# EAGLE design APC1 (EAGLE 7.5.0)
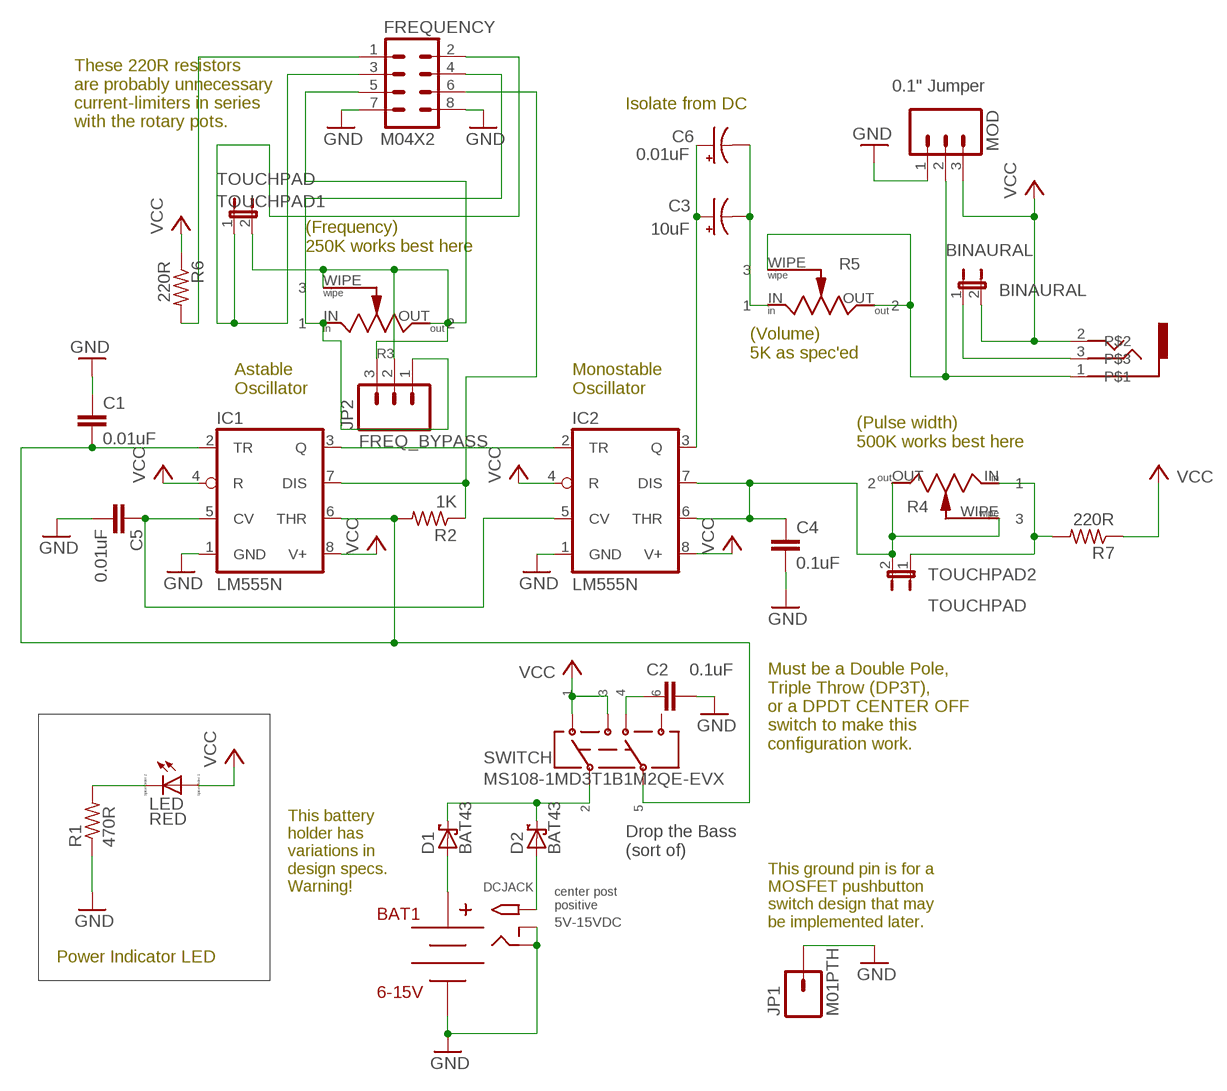
[diagram p0: schematic, sheet 1]

## Parts
BAT1  6-15V  BH-9VPC  [BH9VPC]
BINAURAL  BINAURAL  JP1E  [JP1]
C1  0.01uF  C-EU050-024X044  [C050-024X044]
C2  0.1uF  C-EU050-024X044  [C050-024X044]
C3  10uF  CPOL-USE2.5-7  [E2,5-7]
C4  0.1uF  C-EU050-024X044  [C050-024X044]
C5  0.01uF  C-EU050-024X044  [C050-024X044]
C6  0.01uF  CPOL-USE2.5-7  [E2,5-7]
D1  BAT43  SCHOTTKY-DIODEDO35-7  [DO35-7]
D2  BAT43  SCHOTTKY-DIODEDO35-7  [DO35-7]
DCJACK  PJ102A  [PJ-102A]
FREQUENCY  M04X2  [2X4]
IC1  LM555N  [DIL08]
IC2  LM555N  [DIL08]
JP1  M01PTH  [1X01]
JP2  FREQ_BYPASS  M03SMD_RA_MALE  [1X03_SMD_RA_MALE]
LED  RED  LED_ELD260  [LED_LD260]
LINE  SJ-3523-SMT  [SJ352_AUDIOJACK]
MOD  0.1" Jumper  M03LOCK  [1X03_LOCK]
R1  470R  R-US_0207/7  [0207/7]
R2  1K  R-US_0207/7  [0207/7]
R3  CTS_UM296RE_SERIES_POTENTIOMETERUM296RE  [UM296RE_POTENTIOMETER]
R4  CTS_UM296RE_SERIES_POTENTIOMETERUM296RE  [UM296RE_POTENTIOMETER]
R5  CTS_UM296RE_SERIES_POTENTIOMETERUM296RE  [UM296RE_POTENTIOMETER]
R6  220R  R-US_0207/7  [0207/7]
R7  220R  R-US_0207/7  [0207/7]
SWITCH  MS108-1MD3T1B1M2QE-EVX  [MS108-1MD3T1B1M2QE-EVX]
TOUCHPAD1  TOUCHPAD  JP1E  [JP1]
TOUCHPAD2  TOUCHPAD  JP1E  [JP1]

## Nets
GND: BAT1.P$1(V-) C1.1 C2.2 C4.2 C5.2 DCJACK.P$2(RING) DCJACK.P$3(RING_SW) FREQUENCY.7 FREQUENCY.8 IC1.1(GND) IC2.1(GND) JP1.1 MOD.1 R1.1
N$1: FREQUENCY.5 JP2.2 JP2.3 R3.OUT R3.WIPE TOUCHPAD1.2
N$2: C2.1 SWITCH.P$4
N$3: C4.1 IC2.6(THR) IC2.7(DIS) R4.OUT R4.WIPE TOUCHPAD2.2
N$4: IC1.3(Q) IC2.2(TR)
N$5: C5.1 IC1.5(CV) IC2.5(CV)
N$6: LED.K(C) R1.2
N$7: BINAURAL.1 LINE.3
N$8: C3.+ C6.+ IC2.3(Q)
N$9: C1.2 IC1.2(TR) IC1.6(THR) R2.2 SWITCH.P$5
N$10: BAT1.P$2(V+) D1.A
N$11: D2.A DCJACK.P$1(TIP)
N$13: LINE.1 MOD.2 R5.OUT R5.WIPE
N$14: R4.IN R7.2 TOUCHPAD2.1
N$15: FREQUENCY.2 FREQUENCY.3 TOUCHPAD1.1
N$16: C3.- C6.- R5.IN
N$18: FREQUENCY.1 R6.2
N$19: FREQUENCY.4 JP2.1 R3.IN
N$20: FREQUENCY.6 IC1.7(DIS) R2.1
VCC: BINAURAL.2 IC1.4(R) IC1.8(V+) IC2.4(R) IC2.8(V+) LED.A LINE.2 MOD.3 R6.1 R7.1 SWITCH.P$1 SWITCH.P$3
VIN: D1.C D2.C SWITCH.P$2
Unconnected: SWITCH.P$6

## Notes on the sheet
- Isolate from DC
- These 220R resistors
  are probably unnecessary
  current-limiters in series 
  with the rotary pots.
- (Frequency)
  250K works best here
- (Volume)
  5K as spec'ed
- Astable 
  Oscillator
- Monostable 
  Oscillator
- (Pulse width)
  500K works best here
- Must be a Double Pole,
  Triple Throw (DP3T),
  or a DPDT CENTER OFF
  switch to make this
  configuration work.
- Drop the Bass
  (sort of)
- This battery
  holder has
  variations in
  design specs.
  Warning!
- center post
  positive
- 5V-15VDC
- This ground pin is for a
  MOSFET pushbutton
  switch design that may 
  be implemented later.
- Power Indicator LED

## Library data of the parts
BAT1 = HAMNER:BH-9VPC: These specs, though the battery holder is imprinted with BH-9VPC, match the specs of part number 12BH611-GR. There is another part with SKU BH-9VPC, but very unfortunately, the specs are not quite the same. Apparently the manufacturer was purchased by another conglomerate, resulting in some new/old stock components with identical SKUs.
BINAURAL TOUCHPAD1 TOUCHPAD2 = jumper:JP1E: JUMPER
C1 C2 C4 C5 = rcl:C-EU: CAPACITOR, European symbol
C3 C6 = rcl:CPOL-US: POLARIZED CAPACITOR, American symbol
D1 D2 = adafruit:SCHOTTKY-DIODE: Schottky Diode
DCJACK = HAMNER:PJ102A
FREQUENCY = SparkFun-Connectors:M04X2: .1" header, two rows of four.
IC1 IC2 = linear:*555: TIMER
JP1 = SparkFun-Connectors:M01: Header 1 Standard 1-pin 0.1" header. Use with straight break away headers (SKU : PRT-00116), right angle break away headers (PRT-00553), swiss pins (PRT-00743), machine pins (PRT-00117), and female headers (PRT-00115).
JP2 = SparkFun-Connectors:M03: Header 3 Standard 3-pin 0.1" header. Use with straight break away headers (SKU : PRT-00116), right angle break away headers (PRT-00553), swiss pins (PRT-00743), machine pins (PRT-00117), and female headers (PRT-00115). Molex polarized connector foot print use with SKU : PRT-08232 with associated crimp pins and housings.; PROD_ID: CONN-10925
LED = eagle-ltspice:LED_E: LED Source: http://www.osram.convergy.de Source: www.luxeon.com Source: www.kingbright.com; SPICEMODEL: NONE; SPICEPREFIX: D; SPICETYPE: diode
LINE = HAMNER:SJ-3523-SMT: CUI inc Stereo Audio SMT jack, 3.5mm http://www.digikey.com/product-detail/en/SJ-3523-SMT-TR/CP-3523SJCT-ND/669704
MOD = SparkFun-Connectors:M03: Header 3 Standard 3-pin 0.1" header. Use with straight break away headers (SKU : PRT-00116), right angle break away headers (PRT-00553), swiss pins (PRT-00743), machine pins (PRT-00117), and female headers (PRT-00115). Molex polarized connector foot print use with SKU : PRT-08232 with associated crimp pins and housings.
R1 R2 R6 R7 = rcl:R-US_: RESISTOR, American symbol
R3-R5 = HAMNER:CTS_UM296RE_SERIES_POTENTIOMETER: CTS 296 U series rotary potentiometer / rheostat / varistor / variable resistor. 2009 datasheet vintage. "U" series means "adjustment shaft is perpendicular to the mounting surface". "M" denotes "molded [plastic] shaft." Datasheet <http://www.ctscorp.com/wp-content/uploads/2015/11/296.pdf>. Digikey: Link as of 2016 <http://www.digikey.com/product-search/en/potentiometers-variable-resistors/rotary-potentiometers-rheostats/263488?s=937&page=1&quantity=0&ptm=0&fid=0&pageSize=25>. Resistor Max Value Digikey Part Number Manufacturer Part Number 5K Ohm CT2264-ND 296UD502B1N 100K Ohm CT2268-ND 296UD104B1N 250K Ohm CT2269-ND 296UD254B1N 500K Ohm CT2270-ND 296UD504B1N Mouser: Link as of 2016 <http://www.mouser.com/CTS/Passive-Components/Potentiometers-Trimmers-Rheostats/Potentiometers/296-Series/_/N-9q0yp?P=1ynwx3nZ1yzshzu>, but item is non-stocked and only available in lots of 2000.
SWITCH = HAMNER:MS108-1MD3T1B1M2QE-EVX: Mountain Switch Toggle DPDT model 108-1MD3T1B1M2QE-EVX This model has a center-off (no connection) position It is available from Mouser, part number 108-1MD3T1B1M2QE-EVX Mouser link as of 2016: here <http://www.mouser.com/ProductDetail/Mountain-Switch/108-1MD3T1B1M2QE-EVX/>. Digikey does not carry the part as of 2016. Amazon carries the part, but only in lots of 500.; MOUSER: 108-1MD3T1B1M2QE-EVX

## Board
Atari Punk Console version 1.0 Jesse Hamner UNT Libraries January 2017 In 1983 or some time before that, Forrest Mims III, a legend among the electronics and hobbyist communities, designed the "Stepped Tone Generator" using the wildly popular and hugely versatile 555 timer integrated circuit. He published the design in a Radio Shack (Tandy Corp) book of projects, and then again some time later in another of the "Notebook" series. I was unable to find a design for this board online that presented a simple design and an easy soldering task, but also added a few bits of hackability. People who are getting in to electronics, soldering, and/or "making" need a few easy "wins" for their first few projects, and the "Atari Punk Console", as it has become known, is a simple circuit with a modest amount of expandability. As such, I think this design, as I have re-implemented it, provides a great series of stepping stones from novice, through to a more seasoned "maker". The UNT Libraries makerspace, the Factory, provides a number of makerspace-standard tools to the end users, but like many tools, learning to use them can be a challenge. Here again, this design of the APC is up to the task. With easy alignment notches and a downloadable reference design for a 3D-printed case, users can learn to solder, solder the APC, and print a case for it, without facing serious hurdles. It is my hope that projects such as these provide small curricula, allowing novices to gain experience in several aspects of hobbyist making, while not facing the full force of electrical or industrial engineering. One should not be required to learn typesetting in order to print a Microsoft Word document; neither should one be required to understand G-Code or STL files in order to produce a working and fun electronics project.
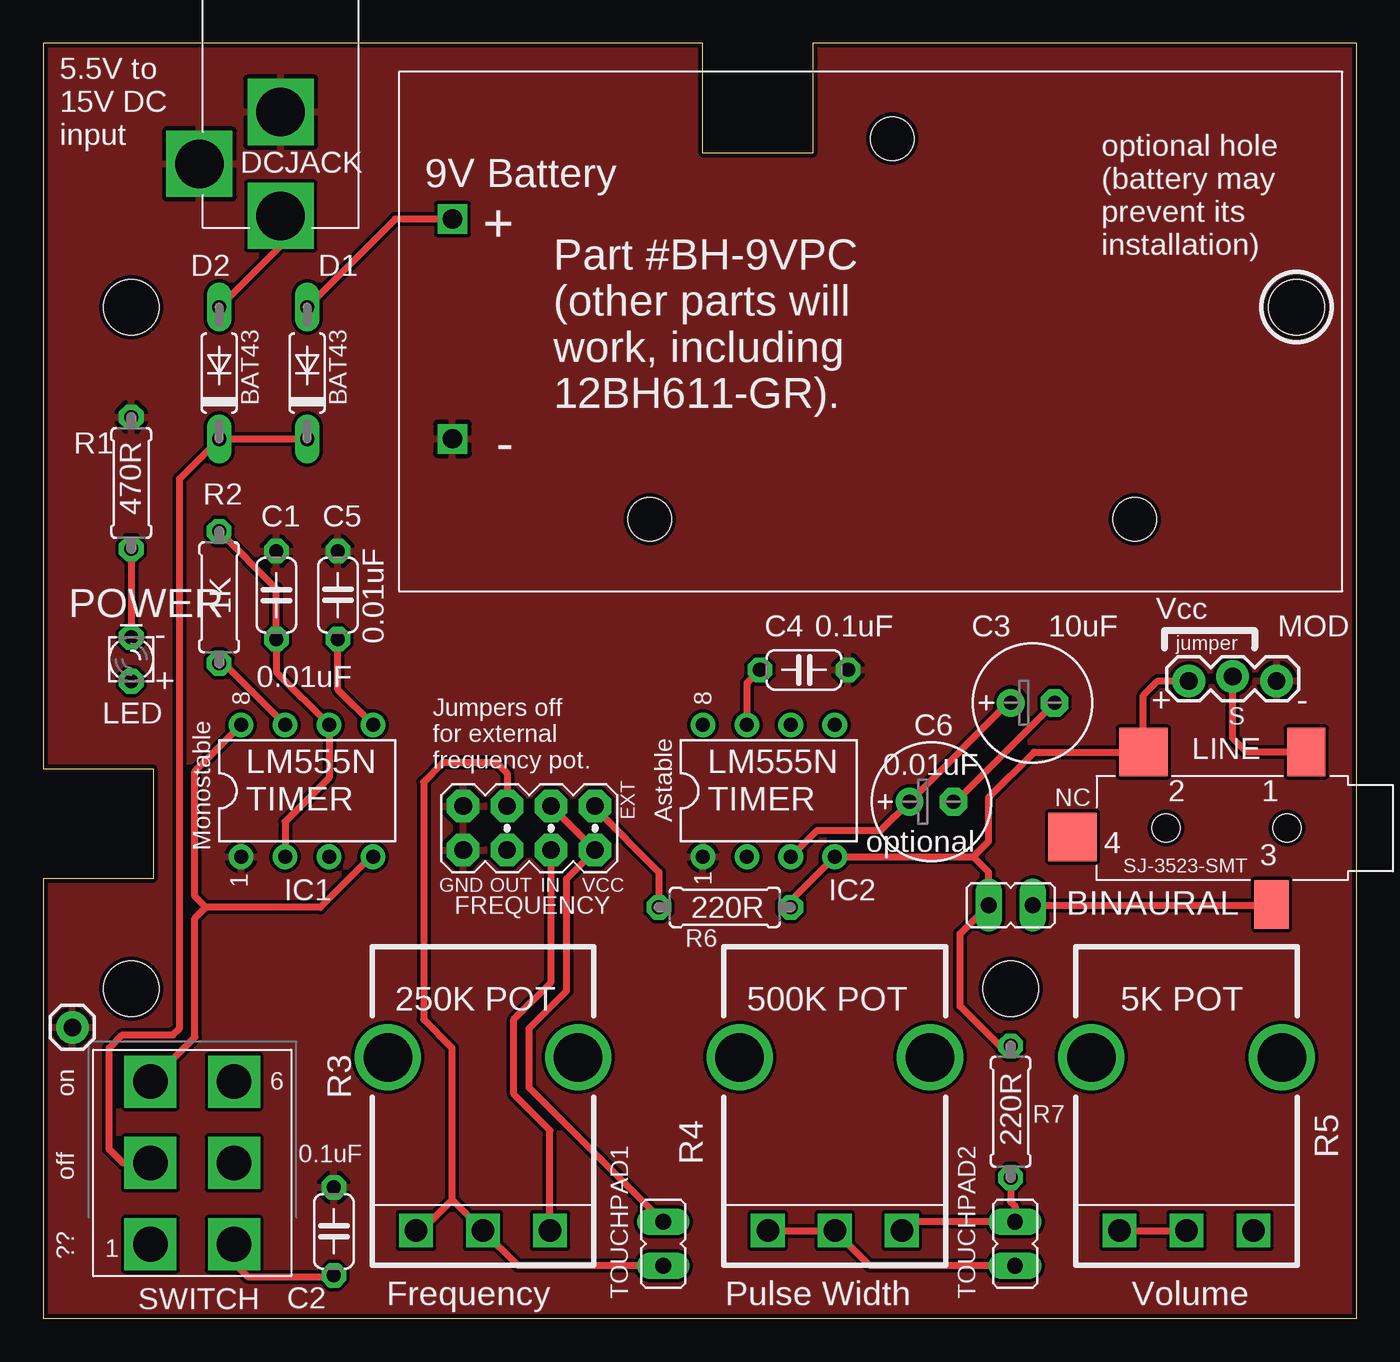
[diagram p1: board, top side]
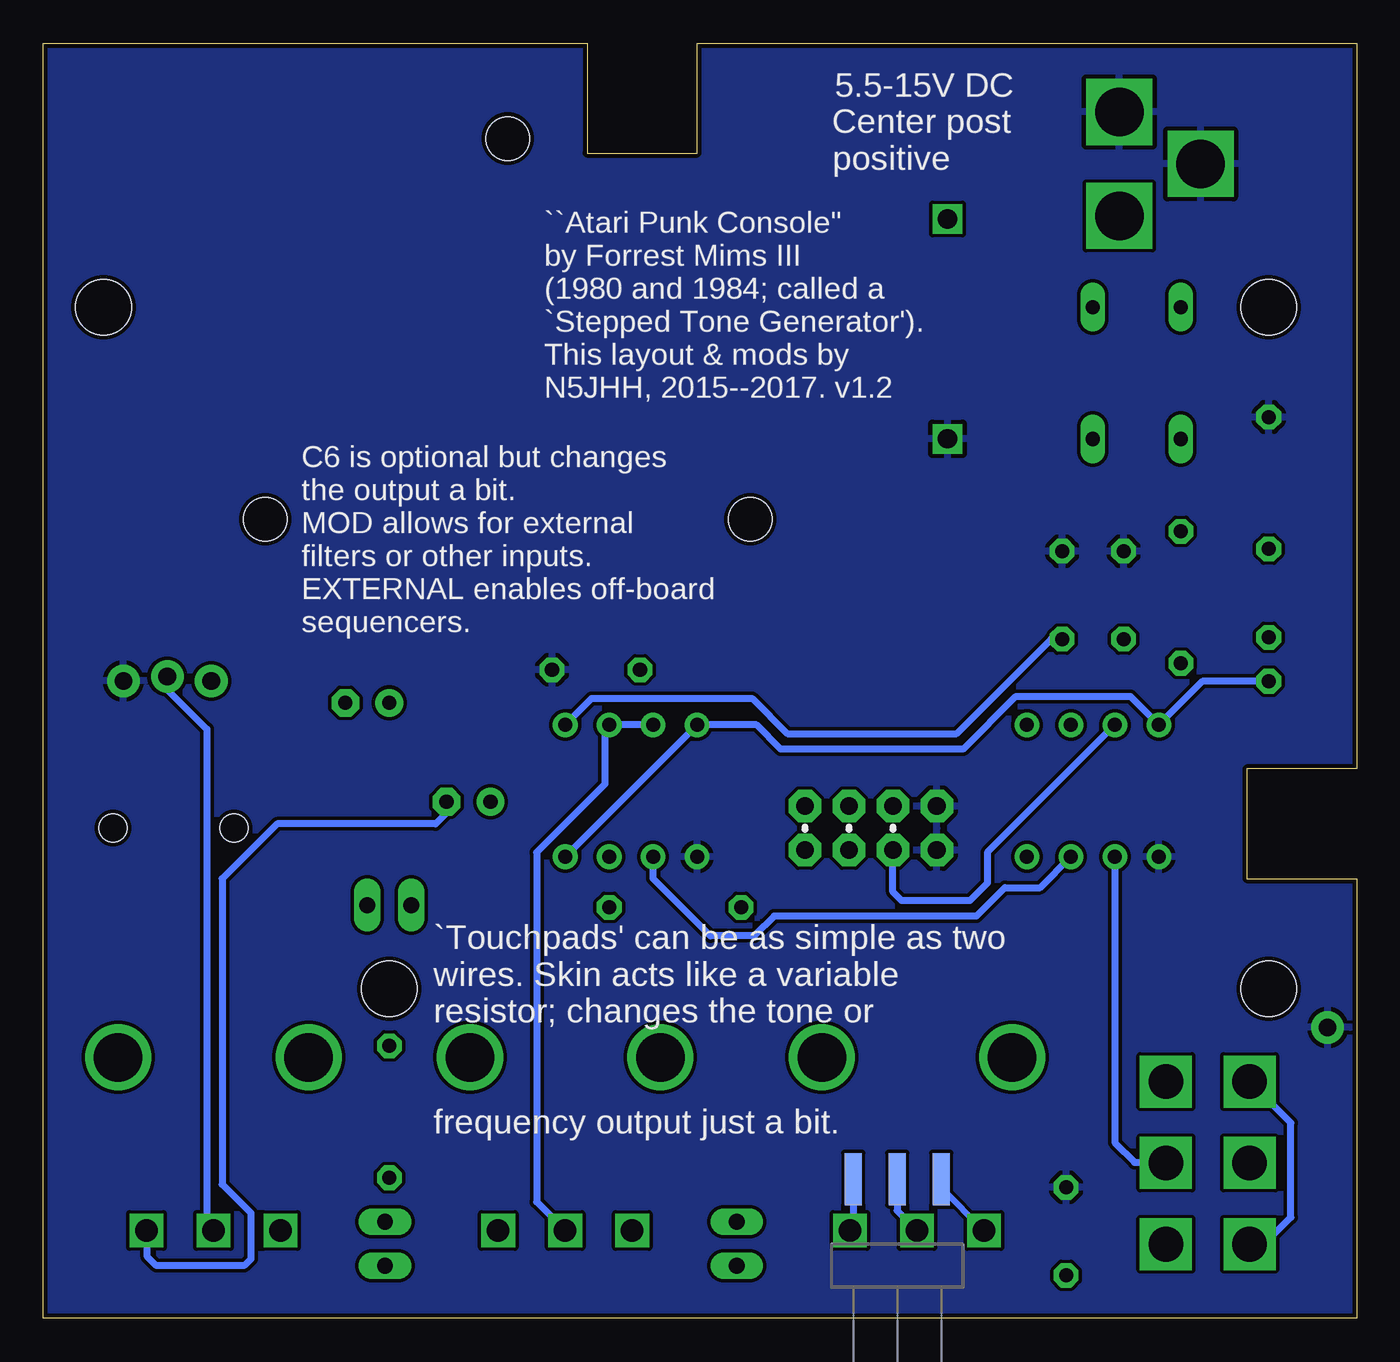
[diagram p2: board, bottom side, seen from below]

Size 75.87 x 73.66 mm. Coordinates in mm from the lower left corner, seen from the top.
Outline: 0,0 75.87,0 75.87,73.66 44.45,73.66 44.45,67.31 38.1,67.31 38.1,73.66 0,73.66 0,31.75 6.35,31.75 6.35,25.4 0,25.4 0,0
Copper layers (1*16): Top 0.035mm / dielectric 1.5mm / Bottom 0.035mm
Design rules "SparkFun": minimum track width 8mil, minimum drill 20mil, track to track 8mil, track to pad 8mil, pad to pad 8mil, via to via 8mil, smd to smd 8mil, copper to edge 10mil, drill to drill 8mil, minimum pad ring 12mil, minimum via ring 10mil, stop-mask expansion 4mil, vias tented up to drill 25mil, thermal gap 10mil
Holes 3.2 mm at 72.39,58.42 55.88,19.05 5.08,58.42 5.08,19.05

### Footprints (pad centres in the part's own frame; a part is rotated, then mirrored left to right if it is on the bottom)
BH9VPC = drill 1.1 square: P$1 26.4,21.2; P$2 26.4,8.5 | hole 2.5: 1,3.85; -13,25.85; 15,25.85
JP1 = drill 0.914 long: 1 0,-1.27; 2 0,1.27
C050-024X044 = drill 0.813 octagon: 1 -2.54,0; 2 2.54,0
E2,5-7 = drill 0.813 pad 1.6: + -1.27,0 | drill 0.813 pad 1.6 octagon: - 1.27,0
DO35-7 = drill 0.813 long: A 3.81,0; C -3.81,0
PJ-102A = drill 2.8 square: P$1 0,0.7; P$2 -4.7,3.7; P$3 0,6.7
2X4 = drill 1.016 pad 1.88 octagon: 1 -3.81,-1.27; 2 -3.81,1.27; 3 -1.27,-1.27; 4 -1.27,1.27; 5 1.27,-1.27; 6 1.27,1.27; 7 3.81,-1.27; 8 3.81,1.27
DIL08 = drill 0.813 pad 1.27: 1 -3.81,-3.81; 2 -1.27,-3.81; 3 1.27,-3.81; 4 3.81,-3.81; 5 3.81,3.81; 6 1.27,3.81; 7 -1.27,3.81; 8 -3.81,3.81
1X01 = drill 1.016 pad 1.88: 1 0,0
1X03_SMD_RA_MALE = smd 1 x 3: 1 -2.54,5; 2 0,5; 3 2.54,5
LED_LD260 = drill 0.813 octagon: A -1.27,0; K 1.27,0
SJ352_AUDIOJACK = smd 2.2 x 2.8: 1 0.2,-4.4 | smd 2.8 x 2.8: 2 9.6,-4.4; 4 13.7,0.5 | smd 2 x 2.8: 3 2.2,4.4 | hole 1.6: 1.3,0; 8.3,0
1X03_LOCK = drill 1.016 pad 1.88: 1 0,0.127; 2 2.54,-0.127; 3 5.08,0.127
0207/7 = drill 0.813 octagon: 1 -3.81,0; 2 3.81,0
UM296RE_POTENTIOMETER = drill 2.8: HOLE1 10,5.5; HOLE2 10,-5.5 | drill 1.3 square: IN 0,-3.87; OUT 0,3.87; WIPE 0,0
MS108-1MD3T1B1M2QE-EVX = drill 2 square: P$1 2,2; P$2 2,6.7; P$3 2,11.4; P$4 6.83,2; P$5 6.83,6.7; P$6 6.83,11.4

### Placement (x,y rotation side)
BAT1  50.04,72.01 180 top
BINAURAL  55.88,23.88 90 top
C1  13.46,41.78 270 top
C2  16.79,5.03 90 top
C3  57.15,35.56 0 top
C4  43.94,37.47 0 top
C5  17.02,41.78 90 top
C6  51.31,29.84 0 top
D1  15.24,54.61 90 top
D2  10.16,54.61 90 top
DCJACK  13.72,62.99 0 top
FREQUENCY  28.07,28.32 180 top
IC1  15.24,30.48 0 top
IC2  41.91,30.48 0 top
JP1  1.68,16.81 0 top
JP2  26.54,3.05 0 bottom
LED  5.08,38.07 90 top
LINE  73.15,28.32 180 top
MOD  71.25,36.96 180 top
R1  5.08,48.26 270 top
R2  10.16,41.66 90 top
R3  25.4,5.08 90 top
R4  45.72,5.08 90 top
R5  66.04,5.08 90 top
R6  39.37,23.75 180 top
R7  55.88,11.94 270 top
SWITCH  4.19,2.29 0 top
TOUCHPAD1  35.81,4.32 180 top
TOUCHPAD2  56.13,4.32 180 top

### Tracks (layer width: path | path; a pad name or v marks a point on that pad's centre or on a via)
GND
  pour Bottom: 0,73.66 76.2,73.66 76.2,0 0,0
  pour Top: 0,73.66 76.2,73.66 76.2,0 0,0
N$1
  Top 0.406: TOUCHPAD1.2 27.43,3.05 R3.WIPE 23.62,6.86 | R3.OUT 21.84,5.08 23.62,6.86 | FREQUENCY.5 26.8,31.5 26.16,32.13 23.11,32.13 21.97,30.99 21.97,17.27 23.62,15.62 23.62,6.86
  Bottom 0.305: R3.OUT 24,7.55
  Bottom 0.406: JP2.3 24,7.55 | JP2.2 26.54,6.22 R3.WIPE
N$2
  Top 0.406: SWITCH.P$4 11.02,3.2 11.81,2.41 16.71,2.41 C2.1
N$3
  Top 0.406: R4.OUT R4.WIPE 47.75,3.05 TOUCHPAD2.2 | C4.1 40.64,36.7 IC2.7
  Bottom 0.406: IC2.7 IC2.6 43.43,34.04 43.43,30.86 47.37,26.92 47.37,6.73 R4.WIPE
N$4
  Bottom 0.406: IC1.3 18.29,24.89 20.32,24.89 21.97,23.24 33.66,23.24 34.8,22.1 37.34,22.1 40.64,25.4 IC2.2
N$5
  Top 0.406: IC1.5 17.02,36.32 C5.1
  Bottom 0.406: IC2.5 44.2,35.81 34.92,35.81 32.89,33.78 23.11,33.78 17.65,39.24 C5.1
N$6
  Top 0.406: R1.2 LED.K
N$7
  Top 0.406: LINE.3 70.4,23.88 BINAURAL.1
N$8
  Top 0.406: 49.91,29.72 C6.+ | C3.+ 55.75,35.56 C6.+ | C6.+ 48.39,28.19 44.7,28.19 IC2.3
N$9
  Top 0.406: IC1.2 13.97,28.7 16.51,31.24 IC1.6 13.46,37.34 C1.2 13.46,42.16 R2.2
  Bottom 0.406: 11.12,8.99 SWITCH.P$5 11.05,9.02 12.83,9.02 13.97,10.16 IC1.2
N$10
  Top 0.406: BAT1.P$2 20.33,63.51 D1.A
N$11
  Top 0.406: DCJACK.P$1 13.72,61.98 D2.A
N$13
  Top 0.406: R5.OUT R5.WIPE | LINE.1 69.51,32.72 68.71,33.53 MOD.2
  Bottom 0.406: R5.WIPE 66.42,5.46 66.42,34.04 68.71,36.32 MOD.2
N$14
  Top 0.406: R4.IN 50.1,5.59 TOUCHPAD2.1 56.13,6.48 55.88,6.73 R7.2
N$15
  Top 0.406: FREQUENCY.3 FREQUENCY.2 30.23,25.4 30.23,18.92 28.07,16.76 28.07,13.34 TOUCHPAD1.1
N$16
  Top 0.406: C6.- 52.7,29.84 C3.-
  Bottom 0.406: C6.- 52.58,29.21 53.21,28.57 62.36,28.57 65.53,25.4 65.53,7.75 63.88,6.1 63.88,3.43 64.26,3.05 69.34,3.05 69.85,3.56 69.85,5.02 R5.IN
N$18
  Top 0.406: FREQUENCY.1 31.88,29.46 35.56,25.78 R6.2
N$19
  Top 0.406: R3.IN 29.27,10.86 27.18,12.95 27.18,17.27 29.34,19.43 FREQUENCY.4
  Bottom 0.406: JP2.1 29.08,5.27 R3.IN
N$20
  Top 0.406: R2.1 10.41,37.85 IC1.7
  Bottom 0.406: IC1.7 21.34,26.92 21.34,25.15 22.35,24.13 26.29,24.13 26.8,24.64 FREQUENCY.6
VCC
  Top 0.406: 63,32.77 LINE.2 | LINE.2 57.23,32.72 54.61,30.1 54.61,27.56 53.72,26.67 | LINE.2 63.55,35.99 64.39,36.83 MOD.3 | R7.1 55.25,15.75 52.96,18.03 52.96,22.23 BINAURAL.2 54.61,25.78 53.72,26.67 | SWITCH.P$3 8.76,16.26 8.76,23.11 9.4,23.75 | IC1.8 8.76,31.62 8.76,24.38 9.4,23.75 | IC1.4 18.92,26.67 16,23.75 9.4,23.75 | R6.1 43.18,24.13 IC2.4 53.72,26.67
  Bottom 0.406: SWITCH.P$1 5.37,4.29 3.81,5.84 3.81,11.3 SWITCH.P$3 | IC1.8 11.43,34.16 | IC1.8 13.08,35.94 19.68,35.94 22.73,32.89 33.27,32.89 34.67,34.29 IC2.8 IC2.4 | LED.A 8.92,36.8 IC1.8
VIN
  Top 0.406: SWITCH.P$2 4.6,8.99 3.81,9.78 3.81,15.62 4.57,16.38 7.49,16.38 7.87,16.76 7.87,48.51 D2.C D1.C

### Text on the board
Document: Watch the height / of the alignment / stubs -- don't let / them interfere with / the battery holder. | Hole in the case / required for / power input. | These areas are / cutouts to mix with / risers in the case to / enable easy alignment. / But NOTE they must / not be tall because of / clearance issues. / 5mm height should / be fine. | Add posts to support / alignment of the PCBs / to match these holes / in the board. | Hole in the case / required for / audio output. | Switch | Potentiometer stems | Cover height: 2.5cm / to clear the battery; / 2.0cm on bottom half
tDocu: Vcc | Vcc | Vcc | Vcc
_tsilk: 5.5V to / 15V DC / input | 9V Battery | optional hole / (battery may / prevent its / installation) | Part #BH-9VPC / (other parts will / work, including / 12BH611-GR). | POWER | Vcc | - | jumper | + | Monostable | 8 | 8 | + | - | Astable | S | Jumpers off / for external / frequency pot. | NC | TIMER | EXT | TIMER | optional | 1 | GND | OUT | IN | VCC | 1 | 250K POT | 500K POT | 5K POT | on | off | ?? | Frequency | Pulse Width | Volume
_bsilk: 5.5-15V DC | Center post / positive | ``Atari Punk Console'' / by Forrest Mims III / (1980 and 1984; called a / `Stepped Tone Generator'). / This layout & mods by / N5JHH, 2015--2017. v1.2 | C6 is optional but changes / the output a bit. / MOD allows for external / filters or other inputs. / EXTERNAL enables off-board / sequencers. | `Touchpads' can be as simple as two / wires. Skin acts like a variable / resistor; changes the tone or / / / frequency output just a bit.